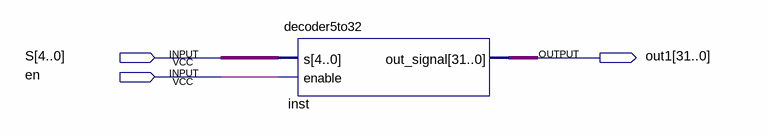
[diagram p0: schematic sheet]
// Quartus schematic DECODETEST.bdf as structural Verilog: 1 symbols, 3 pins
module DECODETEST (
  input  [4:0] S,
  input  en,
  output [31:0] out1
);

  decoder5to32 inst (.s(S), .enable(en), .out_signal(out1));
endmodule
